# Altium schematic sheet PDOC.SchDoc
size A4; SheetNumber: 8; SheetTotal: 11
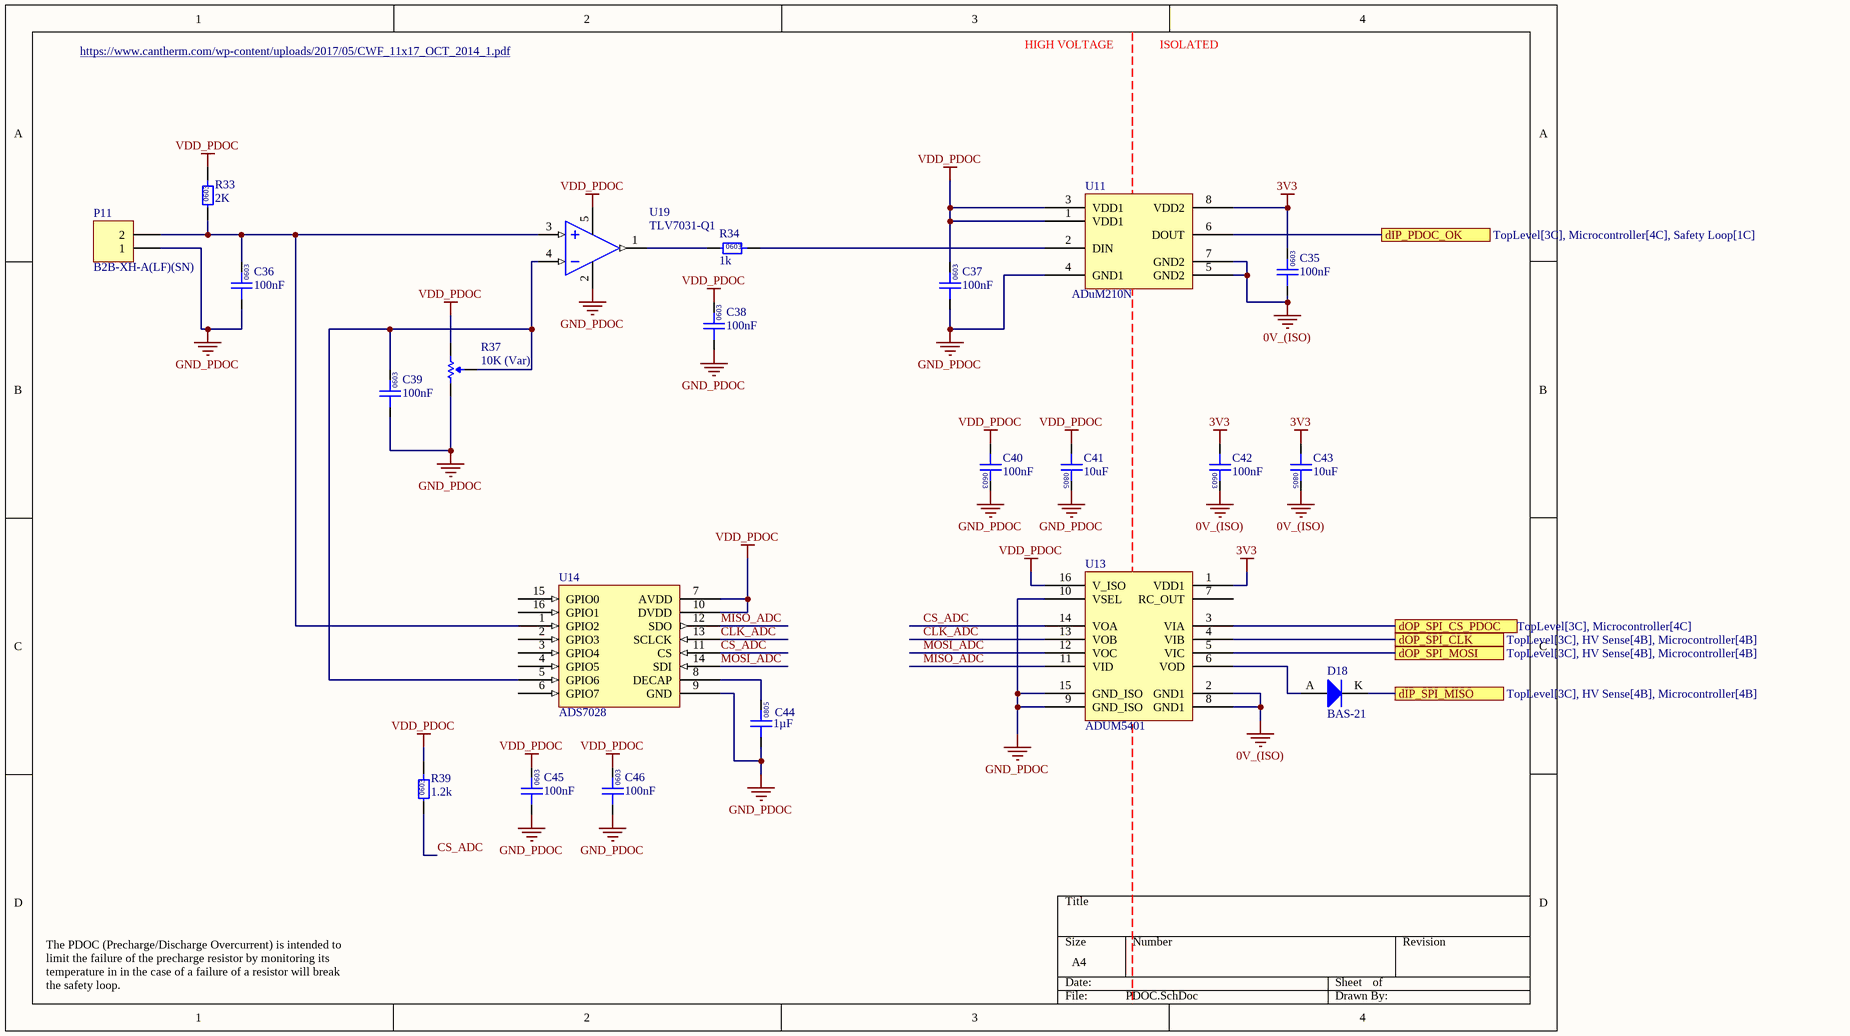
[diagram p0: PDOC.SchDoc]

## Parts
C35  100nF  [0603]
C36  100nF  [0603]
C37  100nF  [0603]
C38  100nF  [0603]
C39  100nF  [0603]
C40  100nF  [0603]
C41  10uF  [0805]
C42  100nF  [0603]
C43  10uF  [0805]
C44  1µF  [0805]
C45  100nF  [0603]
C46  100nF  [0603]
D18  BAS-21  [NEXPERIA_SOT23]
P11  B2B-XH-A(LF)(SN)  [XH 2 PIN VERT]
R33  2K  [0603]
R34  1k  [0603]
R37  10K (Var)  [B 3296]
R39  1.2k  [0603]
U11  ADuM210N  [SOIC-8W]
U13  ADUM5401  [AD 16-SOIC]
U14  ADS7028  [WFQN-16]
U19  TLV7031-Q1  [TI SOT-23-5]

## Ports
dIP_PDOC_OK (see TopLevel[3C], Microcontroller[4C], Safety Loop[1C]), dIP_SPI_MISO (see TopLevel[3C], HV Sense[4B], Microcontroller[4B]), dOP_SPI_CLK (see TopLevel[3C], HV Sense[4B], Microcontroller[4B]), dOP_SPI_CS_PDOC (see TopLevel[3C], Microcontroller[4C]), dOP_SPI_MOSI (see TopLevel[3C], HV Sense[4B], Microcontroller[4B])

## Nets
0V_(ISO): C35.1 C42.2 C43.2 U11.5(GND2) U11.7(GND2) U13.2(GND1) U13.8(GND1)
3V3: C35.2 C42.1 C43.1 U11.8(VDD2) U13.1(VDD1)
GND_PDOC: C36.1 C37.1 C38.1 C39.1 C40.2 C41.2 C44.1 C45.1 C46.1 P11.1 R37.3(CW) U11.4(GND1) U13.9(GND_ISO) U13.10(VSEL) U13.15(GND_ISO) U14.9(GND) U19.2(V-)
VDD_PDOC: C37.2 C38.2 C40.1 C41.1 C45.2 C46.2 R33.2 R37.1(CCW) R39.2 U11.1(VDD1) U11.3(VDD1) U13.16(V_ISO) U14.7(AVDD) U14.10(DVDD) U19.5(Vcc)
CLK_ADC: U13.13(VOB) U14.13(SCLCK)
CS_ADC: R39.1 U13.14(VOA) U14.11(CS)
dIP_PDOC_OK: U11.6(DOUT) ; port dIP_PDOC_OK
dIP_SPI_MISO: D18.K ; port dIP_SPI_MISO
dOP_SPI_CLK: U13.4(VIB) ; port dOP_SPI_CLK
dOP_SPI_CS_PDOC: U13.3(VIA) ; port dOP_SPI_CS_PDOC
dOP_SPI_MOSI: U13.5(VIC) ; port dOP_SPI_MOSI
MISO_ADC: U13.11(VID) U14.12(SDO)
MOSI_ADC: U13.12(VOC) U14.14(SDI)
NetC36_2: C36.2 P11.2 R33.1 U14.1(GPIO2) U19.3(IN+)
NetC39_2: C39.2 R37.2(Wiper) U14.5(GPIO6) U19.4(IN-)
NetC44_2: C44.2 U14.8(DECAP)
NetD18_A: D18.A U13.6(VOD)
NetR34_1: R34.1 U19.1(OUT)
NetR34_2: R34.2 U11.2(DIN)

Not connected (* = marked no-connect by the designer): U13 7(RC_OUT); U14 2(GPIO3) 3(GPIO4) 4(GPIO5) 6(GPIO7) 15(GPIO0) 16(GPIO1)

## Notes on the sheet
- https://www.cantherm.com/wp-content/uploads/2017/05/CWF_11x17_OCT_2014_1.pdf
- HIGH VOLTAGE
- ISOLATED
- The PDOC (Precharge/Discharge Overcurrent) is intended to limit the failure of the precharge resistor by monitoring its temperature in in the case of a failure of a resistor will break the safety loop.
- (in symbol GCM21BR71H105KA03L) 0805
- (in symbol GCM188L81H104KA57D) 0603
- (in symbol GRM21BR6YA106KE43L) 0805
- (in symbol RC0603FR-071KL) 0603
- (in symbol RC0603FR-072KL) 0603
- (in symbol RC0603JR-071K2L) 0603

## Library data of the parts
C35-C40 C42 C45 C46 = GCM188L81H104KA57D: Manufacturer: muRata; Rated Voltage: 50V; Tolerance: ±10%; Material: MLCC; Temperature Rating: X8L; Part Number: GCM188L81H104KA57D; Value: 100nF; Digikey Part Number: 490-6049-1-ND
C41 C43 = GRM21BR6YA106KE43L: Manufacturer: muRata; Rated Voltage: 50V; Tolerance: 10%; Material: MLCC; Temperature Rating: X5R; Part Number: GRM21BR6YA106KE43L; Value: 10uF; Digikey Part Number: 490-10514-6-ND
C44 = GCM21BR71H105KA03L: Manufacturer: muRata; Rated Voltage: 50V; Tolerance: ±10%; Material: MLCC; Temperature Rating: X7R; Part Number: GCM21BR71H105KA03L; Value: 1µF; Digikey Part Number: 490-10675-1-ND
D18 = BAS-21: Manufacturer: Nexperia USA Inc.; Forward Voltage: 1.0V; Breakdown Voltage: 250V; Rated Power: 250mW; Part Number: BAS-21
P11 = B2B-XH-A(LF)(SN): Positions: 2; Pitch: 2.54mm; Angle: 0; Flange: No; Contact: Tin; Part Number: B2B-XH-A(LF)(SN); Row Spacing: 2.54mm; Digikey Part Number: 455-2247-ND; Digikey Link: https://www.digikey.com.au/en/products/detail/jst-sales-america-inc/B2B-XH-A-LF-SN/1651045
R33 = RC0603FR-072KL: Manufacturer: YAGEO; Tolerance: 0.01; Rated Power: 0.1W; Part Number: RC0603FR-072KL; Value: 2K; Digikey Part Number: 311-2.00KHRCT-ND; Material: FR-07
R34 = RC0603FR-071KL: Manufacturer: YAGEO; Tolerance: 0.01; Rated Power: 0.1W; Part Number: RC0603FR-071KL; Value: 1k; Digikey Part Number: 311-1.00KHRCT-ND; Material: FR-07
R37 = 3296W-1-103LF: Manufacturer: Bournes Inc; Tolerance: 0.1; Rated Power: 0.5W; Part Number: 3296W-1-103LF; Value: 10K (Var); Digikey Part Number: 3296W-103LF-ND
R39 = RC0603JR-071K2L: Manufacturer: YAGEO; Tolerance: 0.01; Rated Power: 0.1W; Part Number: RC0603JR-071K2L; Value: 1.2k; Material: FR-07; Digikey Part Number: 311-1.2KGRCT-ND
U11 = CMP-110-000007-1: DIGITAL ISOLATOR, SINGLE CHANNEL; Digikey Link: #https://www.analog.com/media/en/technical-documentation/data-sheets/ADuM210N.pdf#; Part Number: ADuM210N
U13 = ADUM5401: Quad Channel 2.5kV Digital Isolator with isoPower; Manufacturer: Analogue Devices; Part Number: ADUM5401
U14 = ADS7028IRTER: IC ADC 12BIT SAR 16WQFN; Manufacturer: Texas Instruments; Part Number: ADS7028IRTER; Digikey Part Number: ADS7028IRTER; Digikey Link: https://www.digikey.com.au/en/products/detail/texas-instruments/ADS7028IRTER/12696020?s=N4IgTCBcDaIIIBEDKB2ADGAHASQEoBUBRXEAXQF8g
U19 = TLV7031-Q1: Manufacturer: Texas Instruments; Input Voltage: 1.6 to 6.5 V; Channels: 1; Output: Push-Pull; Part Number: TLV7031-Q1; Digikey Part Number: 296-TLV7031QDBVRQ1CT-ND